# EAGLE design untitled (EAGLE 6.5.0)
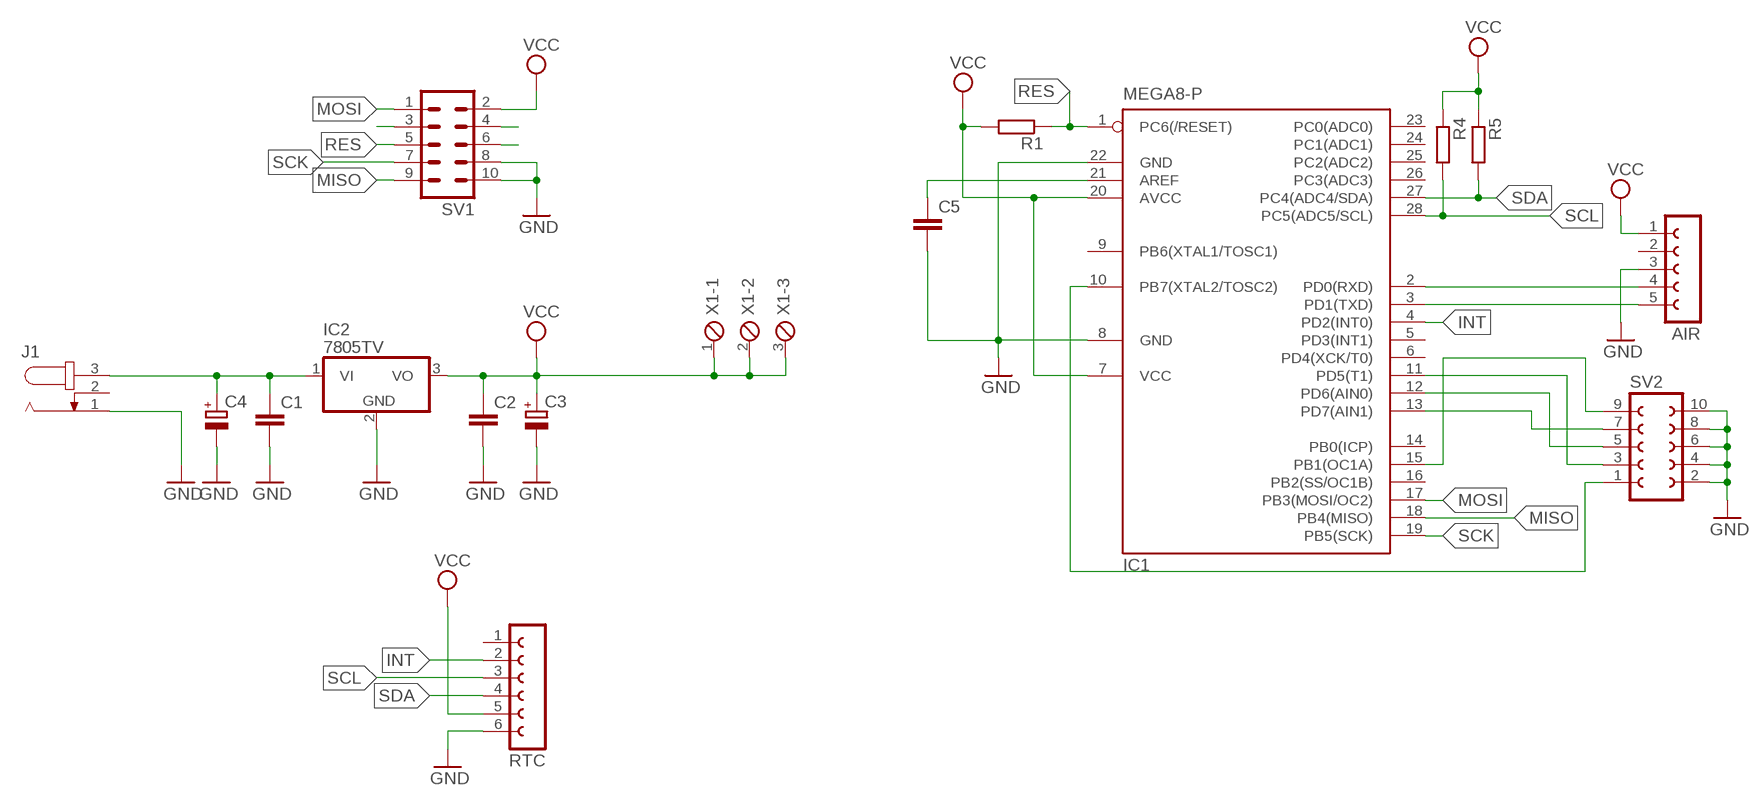
[diagram p0: schematic, sheet 1]

## Parts
AIR  FE05-1  [FE05-1]
C1  C-EU025-025X050  [C025-025X050]
C2  C-EU025-025X050  [C025-025X050]
C3  CPOL-EUE2.5-5  [E2,5-5]
C4  CPOL-EUE3.5-8  [E3,5-8]
C5  C-EU025-025X050  [C025-025X050]
IC1  MEGA8-P  [DIL28-3]
IC2  7805TV  [TO220V]
J1  JACK-PLUG1  [SPC4078]
R1  R-EU_0207/7  [0207/7]
R4  R-EU_0207/7  [0207/7]
R5  R-EU_0207/7  [0207/7]
RTC  FE06-1  [FE06]
SV1  ML10  [ML10]
SV2  FE05-2  [FE05-2]
X1  MPT3  [3POL254]

## Nets
GND: AIR.3 C1.2 C2.2 C3.- C4.- C5.2 IC1.8(GND) IC1.22(GND) IC2.2(GND) J1.1 RTC.6 SV1.8 SV1.10 SV2.2 SV2.4 SV2.6 SV2.8 SV2.10
INT: IC1.4(PD2(INT0)) RTC.2
MISO: IC1.18(PB4(MISO)) SV1.9
MOSI: IC1.17(PB3(MOSI/OC2)) SV1.1
N$1: C1.1 C4.+ IC2.1(VI) J1.3
N$2: SV1.4
N$3: SV1.6
N$4: AIR.4 IC1.2(PD0(RXD))
N$5: AIR.5 IC1.3(PD1(TXD))
N$6: IC1.10(PB7(XTAL2/TOSC2)) SV2.1
N$7: SV1.3
N$8: IC1.15(PB1(OC1A)) SV2.9
N$9: IC1.13(PD7(AIN1)) SV2.7
N$10: IC1.12(PD6(AIN0)) SV2.5
N$11: IC1.11(PD5(T1)) SV2.3
N$12: C5.1 IC1.21(AREF)
RES: IC1.1(PC6(/RESET)) R1.1 SV1.5
SCK: IC1.19(PB5(SCK)) SV1.7
SCL: IC1.28(PC5(ADC5/SCL)) R4.2 RTC.3
SDA: IC1.27(PC4(ADC4/SDA)) R5.2 RTC.4
VCC: AIR.1 C2.1 C3.+ IC1.7(VCC) IC1.20(AVCC) IC2.3(VO) R1.2 R4.1 R5.1 RTC.5 SV1.2 X1.1 X1.2 X1.3
Unconnected: AIR.2 IC1.5(PD3(INT1)) IC1.6(PD4(XCK/T0)) IC1.9(PB6(XTAL1/TOSC1)) IC1.14(PB0(ICP)) IC1.16(PB2(SS/OC1B)) IC1.23(PC0(ADC0)) IC1.24(PC1(ADC1)) IC1.25(PC2(ADC2)) IC1.26(PC3(ADC3)) J1.2 RTC.1

## Library data of the parts
AIR = con-lsta:FE05-1: FEMALE HEADER; OC_FARNELL: unknown; OC_NEWARK: unknown
C1 C2 C5 = rcl:C-EU: CAPACITOR, European symbol
C3 C4 = rcl:CPOL-EU: POLARIZED CAPACITOR, European symbol
IC1 = atmel:MEGA8-P: MICROCONTROLLER 8 Kbytes FLASH, 1 kbytes SRAM, 512 bytes EEPROM, USART, 4-channel 10 bit ADC, 2-channel 8 bit ADC Pin compatible with Atmega48, ATMega88, ATMega168 Source: avr.lbr; OC_FARNELL: unknown; OC_NEWARK: unknown
IC2 = linear:78*: Positive VOLTAGE REGULATOR Source: http://cache.national.com/ds/LM/LM78L05.pdf http://www.fairchildsemi.com/ds/LM/LM7805.pdf
J1 = con-jack:JACK-PLUG: DC POWER JACK Power Jack, DC, Right Angle, Through Hole, Rated 5A at 16VDC, PC Terminals Distributor: Farnell (www.Farnell.de) Drawing: 84N1161.pdf / 84N1162.pdf Manufacturer: SPC Technology (www.spctechnology.com) Type: SPC4077 / SPC 4078; OC_FARNELL: unknown; OC_NEWARK: unknown
R1 R4 R5 = rcl:R-EU_: RESISTOR, European symbol
RTC = con-lsta:FE06-1: FEMALE HEADER; OC_FARNELL: unknown; OC_NEWARK: unknown
SV1 = con-ml:ML10: HARTING; OC_FARNELL: unknown; OC_NEWARK: unknown
SV2 = con-lsta:FE05-2: FEMALE HEADER; OC_FARNELL: unknown; OC_NEWARK: unknown
X1 = con-phoenix-254:MPT3: PHOENIX CONNECTOR; OC_FARNELL: unknown; OC_NEWARK: unknown

## Board
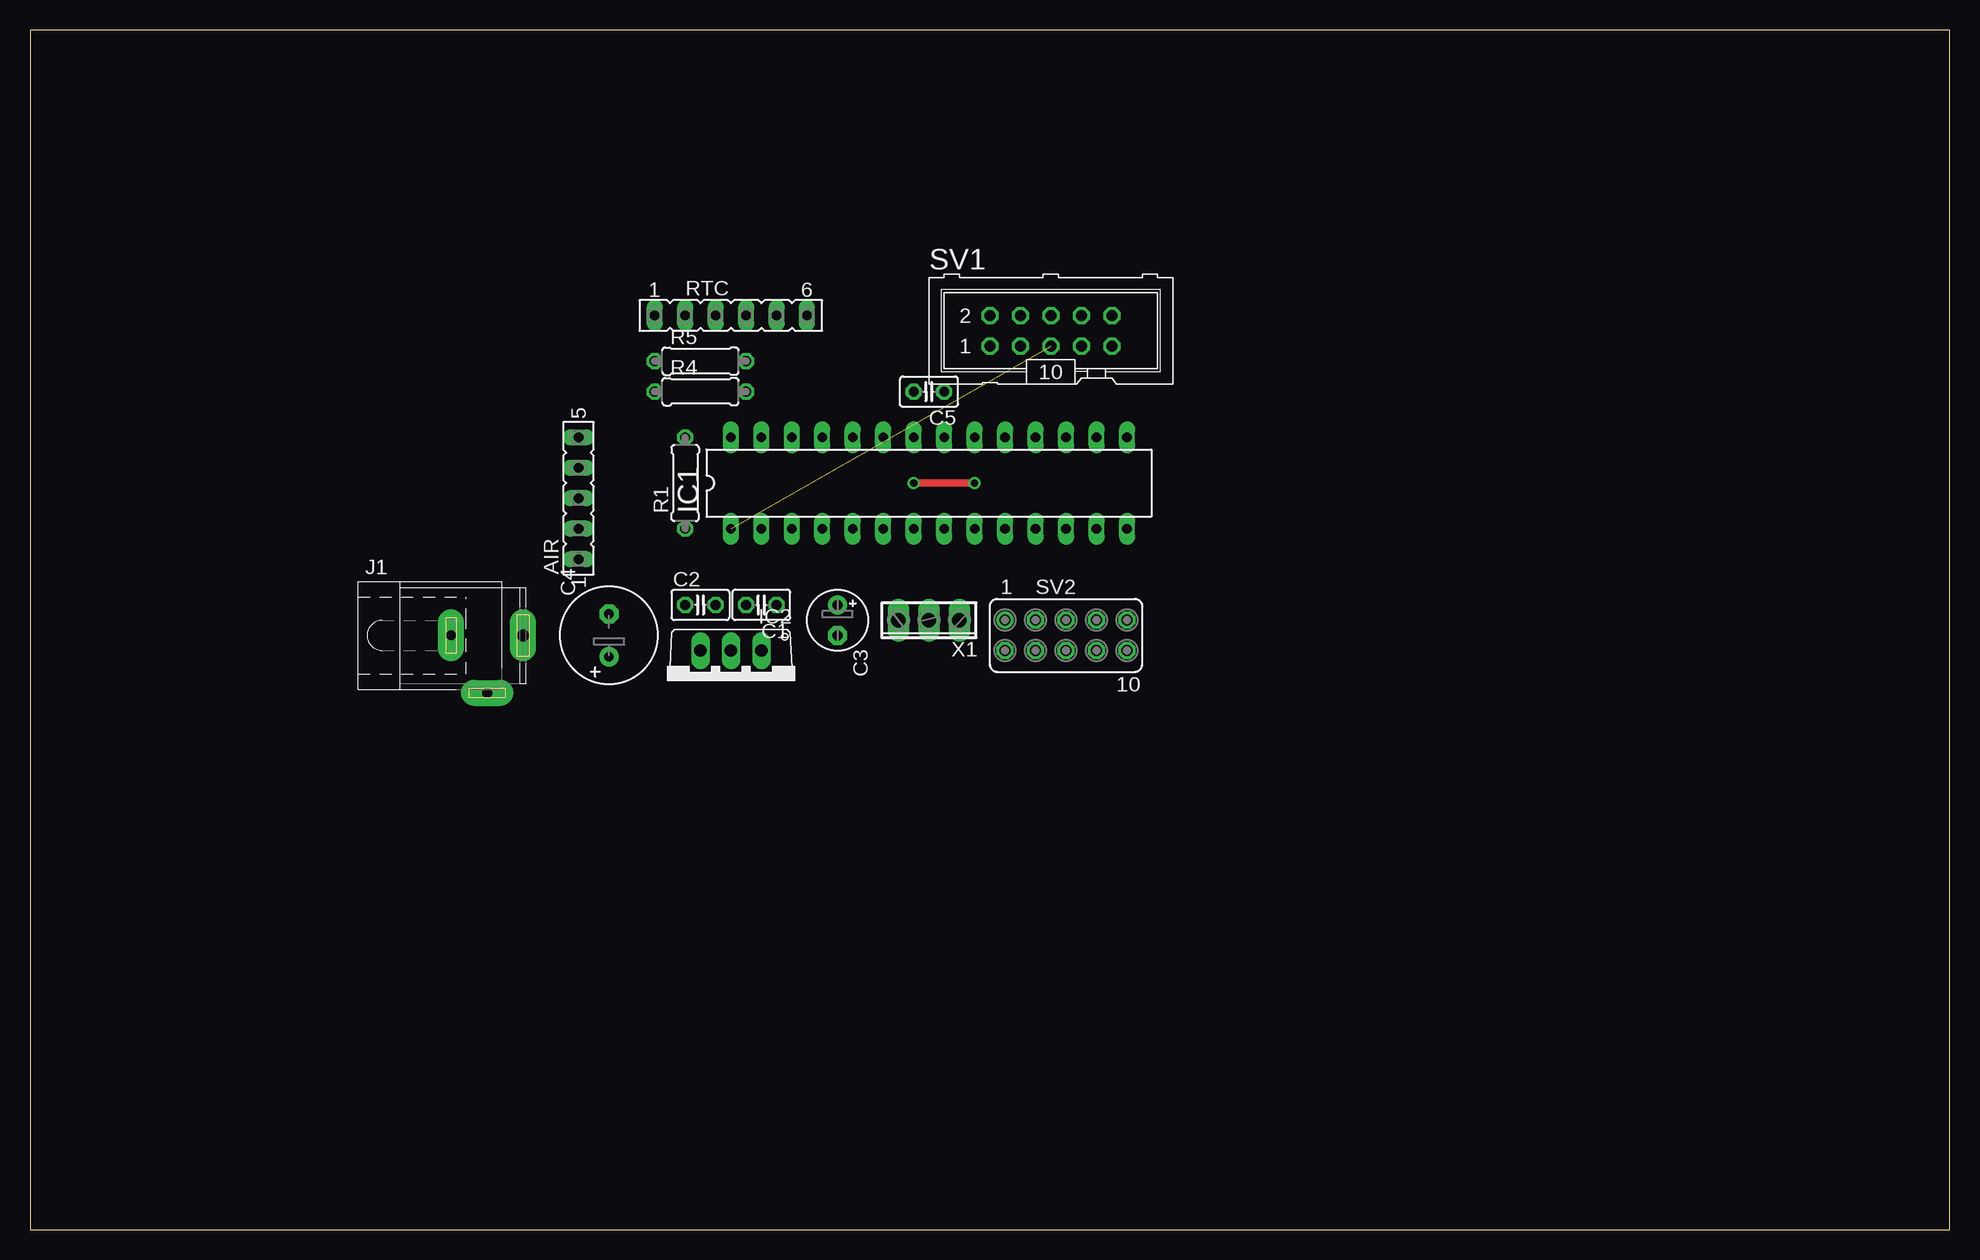
[diagram p1: board, top side]
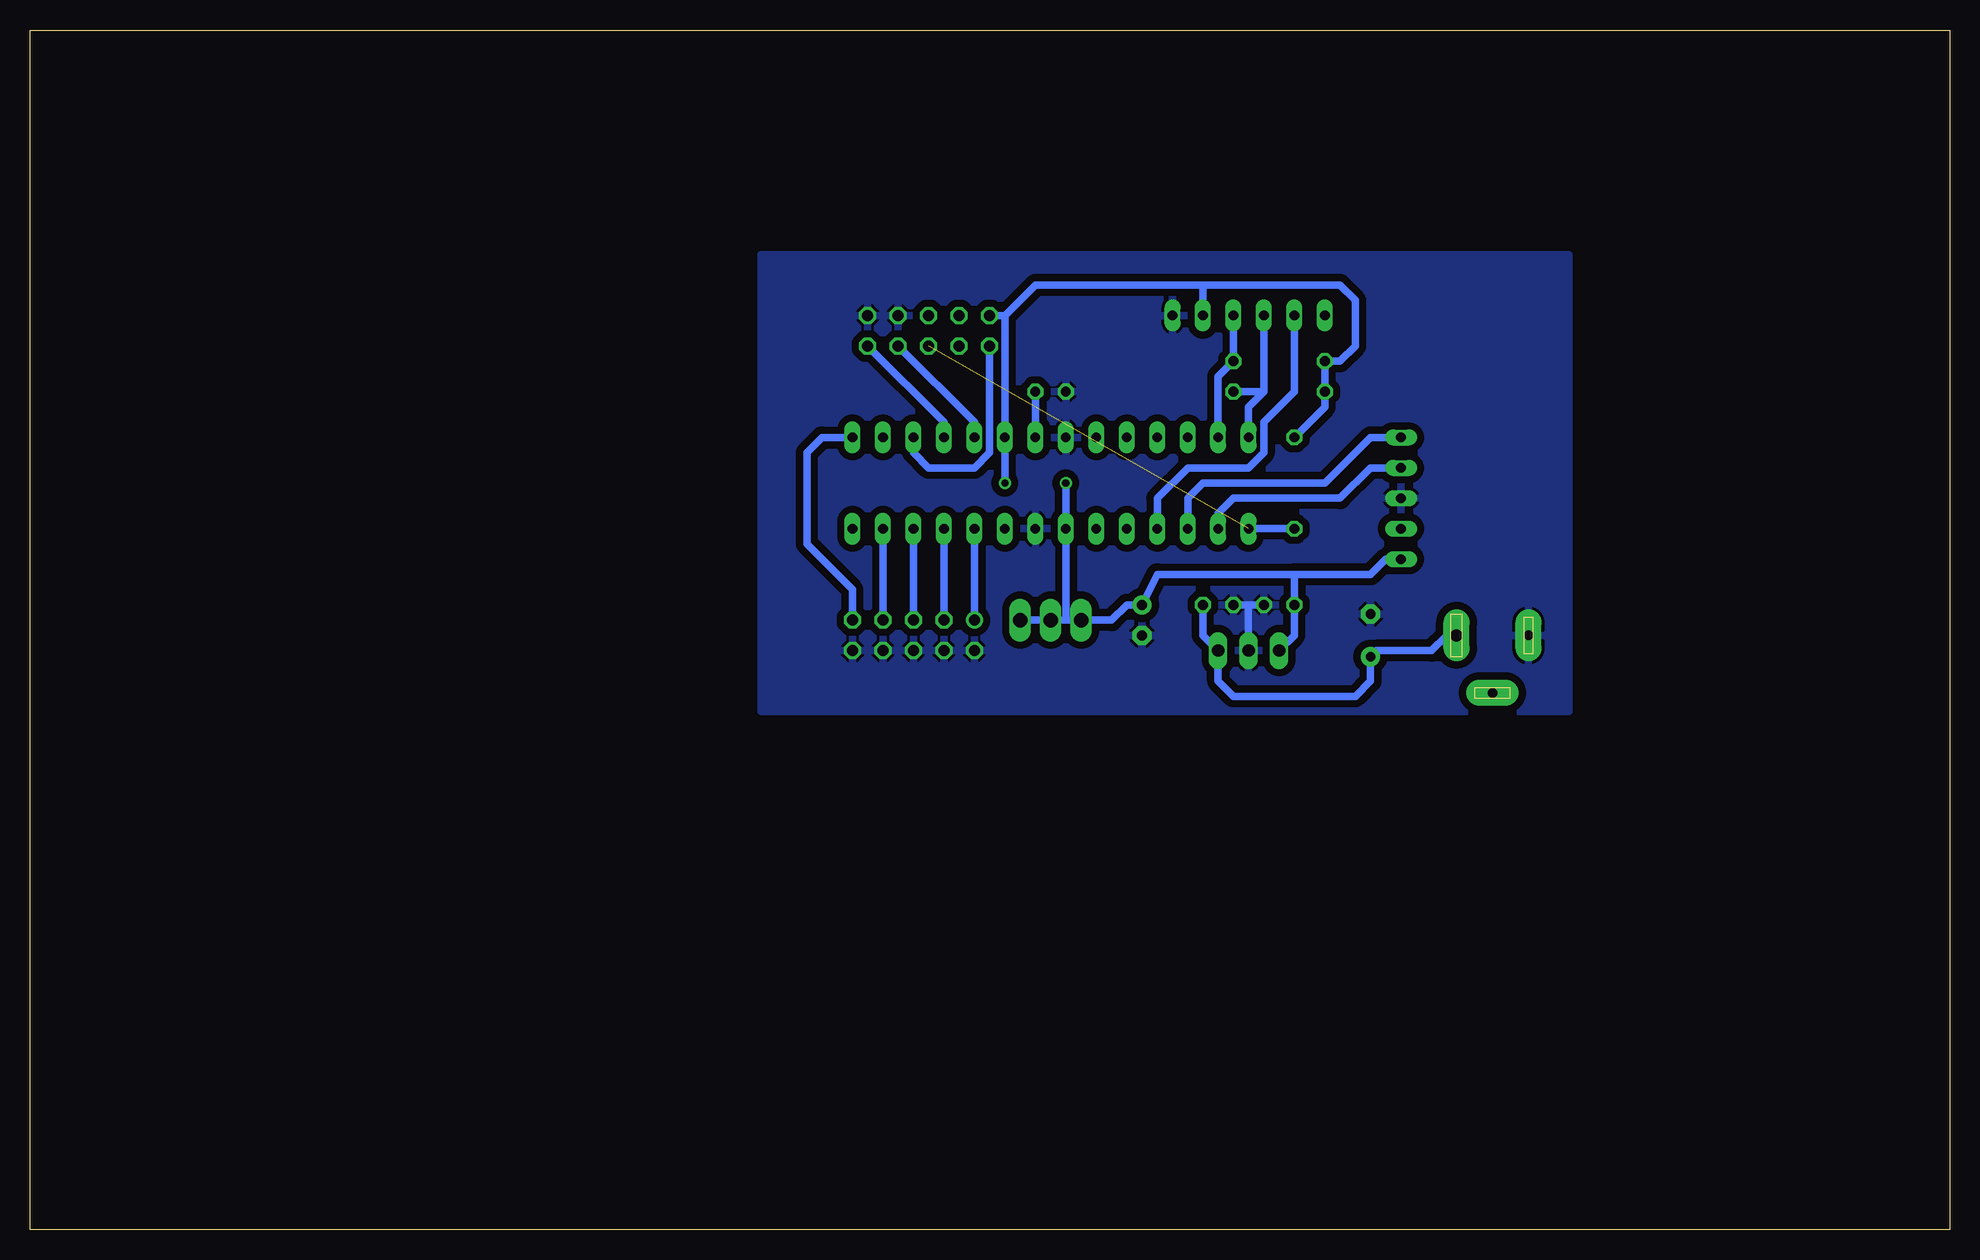
[diagram p2: board, bottom side, seen from below]

Size 160 x 100 mm. Coordinates in mm from the lower left corner, seen from the top.
Outline: 0,0 160,0 160,100 0,100 0,0
Copper layers (1*16): Top 0.035mm / dielectric 1.5mm / Bottom 0.035mm
Design rules "default": minimum track width 10mil, minimum drill 24mil, track to track 8mil, track to pad 8mil, pad to pad 8mil, via to via 8mil, smd to smd 8mil, copper to edge 40mil, drill to drill 8mil, minimum pad ring 10mil, minimum via ring 8mil, stop-mask expansion 4mil, vias tented up to drill 0mil, thermal gap 10mil

### Footprints (pad centres in the part's own frame; a part is rotated, then mirrored left to right if it is on the bottom)
FE05-1 = drill 0.813 long: 1 -5.08,0; 2 -2.54,0; 3 0,0; 4 2.54,0; 5 5.08,0
C025-025X050 = drill 0.813 octagon: 1 -1.27,0; 2 1.27,0
E2,5-5 = drill 0.813 pad 1.6: + -1.27,0 | drill 0.813 pad 1.6 octagon: - 1.27,0
E3,5-8 = drill 0.813 pad 1.6: + -1.778,0 | drill 0.813 pad 1.6 octagon: - 1.778,0
DIL28-3 = drill 0.813 long: 1 -16.51,-3.81; 2 -13.97,-3.81; 3 -11.43,-3.81; 4 -8.89,-3.81; 5 -6.35,-3.81; 6 -3.81,-3.81; 7 -1.27,-3.81; 8 1.27,-3.81; 9 3.81,-3.81; 10 6.35,-3.81; 11 8.89,-3.81; 12 11.43,-3.81; 13 13.97,-3.81; 14 16.51,-3.81; 15 16.51,3.81; 16 13.97,3.81; 17 11.43,3.81; 18 8.89,3.81; 19 6.35,3.81; 20 3.81,3.81; 21 1.27,3.81; 22 -1.27,3.81; 23 -3.81,3.81; 24 -6.35,3.81; 25 -8.89,3.81; 26 -11.43,3.81; 27 -13.97,3.81; 28 -16.51,3.81
TO220V = drill 1.016 long: 1 -2.54,-2.54; 2 0,-2.54; 3 2.54,-2.54
SPC4078 = drill 0.8 pad 2.184 long: 1 -3,0; 2 0,-4.8 | drill 1 pad 2.184 long: 3 3,0
0207/7 = drill 0.813 octagon: 1 -3.81,0; 2 3.81,0
FE06 = drill 0.813 long: 1 -6.35,0; 2 -3.81,0; 3 -1.27,0; 4 1.27,0; 5 3.81,0; 6 6.35,0
ML10 = drill 0.914 octagon: 1 -5.08,-1.27; 2 -5.08,1.27; 3 -2.54,-1.27; 4 -2.54,1.27; 5 0,-1.27; 6 0,1.27; 7 2.54,-1.27; 8 2.54,1.27; 9 5.08,-1.27; 10 5.08,1.27
FE05-2 = drill 0.914: 1 -5.08,1.27 | drill 0.914 octagon: 2 -5.08,-1.27; 3 -2.54,1.27; 4 -2.54,-1.27; 5 0,1.27; 6 0,-1.27; 7 2.54,1.27; 8 2.54,-1.27; 9 5.08,1.27; 10 5.08,-1.27
3POL254 = drill 1.2 long: 1 -2.54,0; 2 0,0; 3 2.54,0

### Placement (x,y rotation side)
AIR  45.72,60.96 90 top
C1  60.96,52.07 180 top
C2  55.88,52.07 0 top
C3  67.31,50.8 270 top
C4  48.26,49.53 90 top
C5  74.93,69.85 180 top
IC1  74.93,62.23 0 top
IC2  58.42,45.72 180 top
J1  38.1,49.53 0 top
R1  54.61,62.23 90 top
R4  55.88,69.85 0 top
R5  55.88,72.39 0 top
RTC  58.42,76.2 0 top
SV1  85.09,74.93 0 top
SV2  86.36,49.53 0 top
X1  74.93,50.8 180 top

### Tracks (layer width: path | path; a pad name or v marks a point on that pad's centre or on a via)
GND
  Bottom 0.61: IC2.2 58.42,52.07 | 58.42,52.07 C2.2 | C1.2 58.42,52.07
  pour Bottom (isolate 0.61): 31.75,81.28 99.06,81.28 99.06,43.18 31.75,43.18
INT
  Bottom 0.61: RTC.2 54.61,69.85 57.15,67.31 57.15,64.77 58.42,63.5 63.5,63.5 66.04,60.96 IC1.4
MISO
  Bottom 0.61: IC1.18 83.82,67.31 SV1.9
MOSI
  Bottom 0.61: SV1.1 80.01,64.77 81.28,63.5 85.09,63.5 86.36,64.77 IC1.17
N$1
  Bottom 0.61: 40.64,49.53 J1.3 41.91,49.53 43.18,48.26 47.75,48.26 C4.+ 48.26,45.72 49.53,44.45 59.69,44.45 60.96,45.72 IC2.1 62.23,49.53 C1.1
N$4
  Bottom 0.61: IC1.2 60.96,59.69 59.69,60.96 50.8,60.96 48.26,63.5 AIR.4
N$5
  Bottom 0.61: IC1.3 63.5,60.96 62.23,62.23 52.07,62.23 48.26,66.04 AIR.5
N$6
  Bottom 0.61: IC1.10 SV2.1
N$8
  Bottom 0.61: SV2.9 91.44,53.34 95.25,57.15 95.25,64.77 93.98,66.04 IC1.15
N$9
  Bottom 0.61: IC1.13 SV2.7
N$10
  Bottom 0.61: IC1.12 SV2.5
N$11
  Bottom 0.61: IC1.11 SV2.3
N$12
  Bottom 0.61: C5.1 IC1.21
RES  (1 unrouted)
  Bottom 0.61: R1.1 IC1.1
SCK
  Bottom 0.61: IC1.19 81.28,67.31 SV1.7
SCL
  Bottom 0.61: RTC.3 57.15,69.85 | 57.15,69.85 58.42,68.58 IC1.28 | R4.2 57.15,69.85
SDA
  Bottom 0.61: RTC.4 R5.2 60.96,71.12 IC1.27
VCC  (via drill 0.6)
  Top 0.61: v73.66,62.23 v78.74,62.23
  Bottom 0.61: IC2.3 54.61,49.53 C2.1 54.61,54.61 | AIR.1 46.99,55.88 48.26,54.61 54.61,54.61 | R1.2 52.07,68.58 R4.1 R5.1 50.8,72.39 49.53,73.66 49.53,77.47 50.8,78.74 62.23,78.74 | 78.74,76.2 SV1.2 | RTC.5 62.23,78.74 | v73.66,62.23 IC1.7 73.66,50.8 | v78.74,62.23 IC1.20 78.74,76.2 | 73.66,50.8 X1.3 69.85,50.8 68.58,52.07 C3.+ 66.04,54.61 54.61,54.61 | X1.1 X1.2 73.66,50.8 | 62.23,78.74 76.2,78.74 78.74,76.2